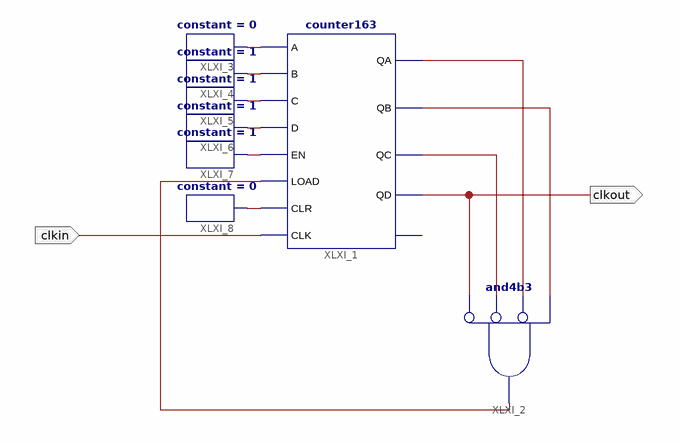
[diagram p0: schematic sheet 1]
// Xilinx ISE schematic clk2.sch (spartan3e) as structural Verilog: 8 symbols, 2 ports
module clk2 (
  input  clkin,
  output clkout
);

  wire XLXN_2, XLXN_5, XLXN_6, XLXN_7, XLXN_8, XLXN_9, XLXN_10, XLXN_11, XLXN_13, XLXN_14;

  counter163 XLXI_1 (
    .A(XLXN_6), .B(XLXN_7), .C(XLXN_8), .D(XLXN_9), .EN(XLXN_10), .LOAD(XLXN_5), .CLR(XLXN_11), .CLK(clkin),
    .QA(XLXN_2), .QD(clkout), .QB(XLXN_14), .QC(XLXN_13));  // open: RCO
  and XLXI_2 (XLXN_5, ~clkout, ~XLXN_13, ~XLXN_2, XLXN_14);  // and4b3
  constant #(.CValue("0")) XLXI_3 (.O(XLXN_6));
  constant #(.CValue("1")) XLXI_4 (.O(XLXN_7));
  constant #(.CValue("1")) XLXI_5 (.O(XLXN_8));
  constant #(.CValue("1")) XLXI_6 (.O(XLXN_9));
  constant #(.CValue("1")) XLXI_7 (.O(XLXN_10));
  constant #(.CValue("0")) XLXI_8 (.O(XLXN_11));
endmodule
